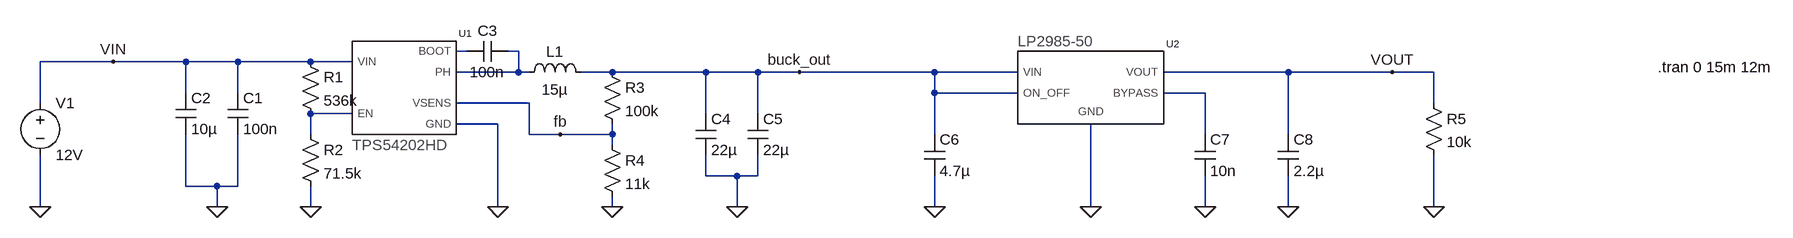
[diagram p0: schematic Draft1.asc]
Draft1.asc, the LTspice schematic file:
Version 4
SHEET 1 2264 680
WIRE 192 96 176 96
WIRE 272 96 256 96
WIRE -352 112 -464 112
WIRE -240 112 -352 112
WIRE -160 112 -240 112
WIRE -48 112 -160 112
WIRE 16 112 -48 112
WIRE 272 128 272 96
WIRE 272 128 176 128
WIRE 288 128 272 128
WIRE 416 128 368 128
WIRE 560 128 416 128
WIRE 640 128 560 128
WIRE 704 128 640 128
WIRE 912 128 704 128
WIRE 1040 128 912 128
WIRE 1456 128 1264 128
WIRE 1616 128 1456 128
WIRE 1680 128 1616 128
WIRE -240 160 -240 112
WIRE -160 160 -160 112
WIRE 912 160 912 128
WIRE 1040 160 912 160
WIRE 1328 160 1264 160
WIRE -464 176 -464 112
WIRE 288 176 176 176
WIRE 1680 176 1680 128
WIRE 16 192 -48 192
WIRE 560 192 560 128
WIRE 640 192 640 128
WIRE 240 208 176 208
WIRE -48 224 -48 192
WIRE 288 224 288 176
WIRE 336 224 288 224
WIRE 416 224 416 208
WIRE 416 224 336 224
WIRE 912 224 912 160
WIRE 1328 224 1328 160
WIRE 1456 224 1456 128
WIRE 416 240 416 224
WIRE 560 288 560 256
WIRE 608 288 560 288
WIRE 640 288 640 256
WIRE 640 288 608 288
WIRE -240 304 -240 224
WIRE -192 304 -240 304
WIRE -160 304 -160 224
WIRE -160 304 -192 304
WIRE -464 336 -464 256
WIRE -192 336 -192 304
WIRE -48 336 -48 304
WIRE 240 336 240 208
WIRE 416 336 416 320
WIRE 608 336 608 288
WIRE 912 336 912 288
WIRE 1152 336 1152 208
WIRE 1328 336 1328 288
WIRE 1456 336 1456 288
WIRE 1680 336 1680 256
FLAG -48 336 0
FLAG -192 336 0
FLAG 416 336 0
FLAG 240 336 0
FLAG 608 336 0
FLAG 336 224 fb
FLAG 704 128 buck_out
FLAG -352 112 VIN
FLAG 912 336 0
FLAG 1152 336 0
FLAG 1328 336 0
FLAG 1456 336 0
FLAG 1616 128 VOUT
FLAG 1680 336 0
FLAG -464 336 0
SYMBOL TPS54202H 96 176 R0
SYMATTR InstName U1
SYMBOL res -64 96 R0
SYMATTR InstName R1
SYMATTR Value 536k
SYMBOL res -64 208 R0
SYMATTR InstName R2
SYMATTR Value 71.5k
SYMBOL cap -176 160 R0
SYMATTR InstName C1
SYMATTR Value 100n
SYMBOL cap -256 160 R0
SYMATTR InstName C2
SYMATTR Value 10µ
SYMBOL cap 256 80 R90
WINDOW 0 0 32 VBottom 2
WINDOW 3 32 32 VTop 2
SYMATTR InstName C3
SYMATTR Value 100n
SYMBOL ind 272 144 R270
WINDOW 0 32 56 VTop 2
WINDOW 3 5 56 VBottom 2
SYMATTR InstName L1
SYMATTR Value 15µ
SYMBOL res 400 112 R0
SYMATTR InstName R3
SYMATTR Value 100k
SYMBOL res 400 224 R0
SYMATTR InstName R4
SYMATTR Value 11k
SYMBOL cap 544 192 R0
SYMATTR InstName C4
SYMATTR Value 22µ
SYMBOL cap 624 192 R0
SYMATTR InstName C5
SYMATTR Value 22µ
SYMBOL LP2985-50 1104 128 R0
SYMATTR InstName U2
SYMBOL cap 896 224 R0
SYMATTR InstName C6
SYMATTR Value 4.7µ
SYMBOL cap 1312 224 R0
SYMATTR InstName C7
SYMATTR Value 10n
SYMBOL cap 1440 224 R0
SYMATTR InstName C8
SYMATTR Value 2.2µ
SYMBOL res 1664 160 R0
SYMATTR InstName R5
SYMATTR Value 10k
SYMBOL voltage -464 160 R0
WINDOW 123 0 0 Left 0
WINDOW 39 0 0 Left 0
SYMATTR InstName V1
SYMATTR Value 12V
TEXT 2024 120 Left 2 !.tran 0 15m 12m

The netlist it stands for:
* Draft1.asc
XU1 N001 N004 0 N002 VIN fb TPS54202H_TRANS TPS54202H_TRANS  ; pins BOOT EN GND PH VIN VSENS
R1 VIN N004 536k
R2 N004 0 71.5k
C1 VIN 0 100n
C2 VIN 0 10µ
C3 N002 N001 100n
L1 N002 buck_out 15µ
R3 buck_out fb 100k
R4 fb 0 11k
C4 buck_out 0 22µ
C5 buck_out 0 22µ
XU2 buck_out 0 buck_out N003 VOUT LP2985-50 LP2985-50  ; pins VIN GND ON_OFF BYPASS VOUT
C6 buck_out 0 4.7µ
C7 N003 0 10n
C8 VOUT 0 2.2µ
R5 VOUT 0 10k
V1 VIN 0 12V
.tran 0 15m 12m
.lib ../libraries/poprawiony_model.lib
.lib ../libraries/LP2985-50.LIB
.backanno
.end